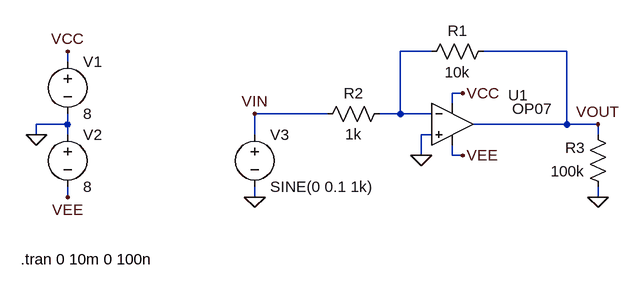
[diagram p0: schematic OP07_Inverter.asc]
OP07_Inverter.asc, the LTspice schematic file:
Version 4
SHEET 1 880 680
WIRE 528 48 480 48
WIRE 736 48 608 48
WIRE -32 64 -32 48
WIRE 576 112 560 112
WIRE 560 128 560 112
WIRE 368 144 256 144
WIRE 480 144 480 48
WIRE 480 144 448 144
WIRE 528 144 480 144
WIRE -32 160 -32 144
WIRE -32 160 -80 160
WIRE 736 160 736 48
WIRE 736 160 592 160
WIRE 784 160 736 160
WIRE -80 176 -80 160
WIRE -32 176 -32 160
WIRE 256 176 256 144
WIRE 528 176 512 176
WIRE 784 176 784 160
WIRE 512 208 512 176
WIRE 560 208 560 192
WIRE 576 208 560 208
WIRE -32 272 -32 256
WIRE 256 272 256 256
WIRE 784 272 784 256
FLAG -32 48 VCC
FLAG 576 112 VCC
FLAG -32 272 VEE
FLAG 576 208 VEE
FLAG -80 176 0
FLAG 256 272 0
FLAG 512 208 0
FLAG 784 272 0
FLAG 256 144 VIN
FLAG 784 160 VOUT
SYMBOL voltage -32 48 R0
WINDOW 123 0 0 Left 0
WINDOW 39 0 0 Left 0
SYMATTR InstName V1
SYMATTR Value 8
SYMBOL voltage -32 160 R0
WINDOW 123 0 0 Left 0
WINDOW 39 0 0 Left 0
SYMATTR InstName V2
SYMATTR Value 8
SYMBOL OpAmps\\OP07 560 96 R0
WINDOW 0 86 19 Left 2
WINDOW 3 92 40 Left 2
SYMATTR InstName U1
SYMBOL res 624 32 R90
WINDOW 0 0 56 VBottom 2
WINDOW 3 32 56 VTop 2
SYMATTR InstName R1
SYMATTR Value 10k
SYMBOL res 464 128 R90
WINDOW 0 0 56 VBottom 2
WINDOW 3 32 56 VTop 2
SYMATTR InstName R2
SYMATTR Value 1k
SYMBOL res 800 272 R180
WINDOW 0 36 76 Left 2
WINDOW 3 36 40 Left 2
SYMATTR InstName R3
SYMATTR Value 100k
SYMBOL voltage 256 160 R0
WINDOW 123 0 0 Left 0
WINDOW 39 0 0 Left 0
SYMATTR InstName V3
SYMATTR Value SINE(0 0.1 1k)
TEXT -104 368 Left 2 !.tran 0 10m 0 100n

The netlist it stands for:
* OP07_Inverter.asc
V1 VCC 0 8
V2 0 VEE 8
XU1 0 N001 VCC VEE VOUT LT1001  ; OP07, pins In+ In- V+ V- OUT
R1 VOUT N001 10k
R2 N001 VIN 1k
R3 0 VOUT 100k
V3 VIN 0 SINE(0 0.1 1k)
.tran 0 10m 0 100n
.lib LTC.lib
.backanno
.end